# Altium schematic sheet LPCB235 - RM48 - N2HET.SchDoc
size A3; Address1: Unit 4; DocumentNumber: 29; Revision: 2; SheetNumber: 29; SheetTotal: 37; Lockie__PCB_SUB_ASSEMBLY: N2HET; Lockie__PCB_ASSEMBLY: FCU PCB; Lockie__LDL: LPCB235; Lockie__PCB_DESCRIPTION: Flight Control Unit
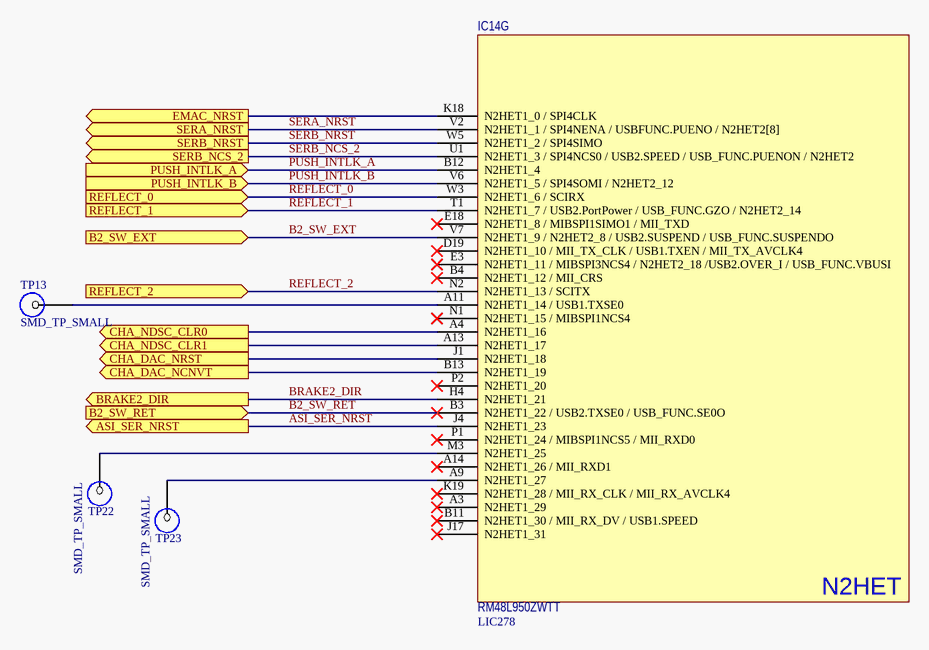
[diagram p0: LPCB235 - RM48 - N2HET.SchDoc]

## Parts
IC14  RM48L950ZWTT  LDL_NUMBER: LIC278  [LFP054__ZWT (S-PBGA-N337)]  (part G of 10)
TP13  SMD_TP_SMALL  [SMD-TP-SMALL]  (no BOM)
TP22  SMD_TP_SMALL  [SMD-TP-SMALL]  (no BOM)
TP23  SMD_TP_SMALL  [SMD-TP-SMALL]  (no BOM)

## Ports
ASI_SER_NRST (out), B2_SW_EXT (in), B2_SW_RET (in), BRAKE2_DIR (out), CHA_DAC_NCNVT (out), CHA_DAC_NRST (out), CHA_NDSC_CLR0 (out), CHA_NDSC_CLR1 (out), EMAC_NRST (out), PUSH_INTLK_A (in), PUSH_INTLK_B (in), REFLECT_0 (in), REFLECT_1 (in), REFLECT_2 (in), SERA_NRST (out), SERB_NCS_2 (out), SERB_NRST (out)

## Nets
ASI_SER_NRST: IC14.J4(N2HET1_23) ; port ASI_SER_NRST
B2_SW_EXT: IC14.V7(N2HET1_9_/_N2HET2_8_/_USB2.SUSPEND_/_USB_FUNC.SUSPENDO) ; port B2_SW_EXT
B2_SW_RET: IC14.B3(N2HET1_22_/_USB2.TXSE0_/_USB_FUNC.SE0O) ; port B2_SW_RET
BRAKE2_DIR: IC14.H4(N2HET1_21) ; port BRAKE2_DIR
CHA_DAC_NCNVT: IC14.B13(N2HET1_19) ; port CHA_DAC_NCNVT
CHA_DAC_NRST: IC14.J1(N2HET1_18) ; port CHA_DAC_NRST
CHA_NDSC_CLR0: IC14.A4(N2HET1_16) ; port CHA_NDSC_CLR0
CHA_NDSC_CLR1: IC14.A13(N2HET1_17) ; port CHA_NDSC_CLR1
EMAC_NRST: IC14.K18(N2HET1_0_/_SPI4CLK) ; port EMAC_NRST
PUSH_INTLK_A: IC14.B12(N2HET1_4) ; port PUSH_INTLK_A
PUSH_INTLK_B: IC14.V6(N2HET1_5_/_SPI4SOMI_/_N2HET2_12) ; port PUSH_INTLK_B
REFLECT_0: IC14.W3(N2HET1_6_/_SCIRX) ; port REFLECT_0
REFLECT_1: IC14.T1(N2HET1_7_/_USB2.PortPower_/_USB_FUNC.GZO_/_N2HET2_14) ; port REFLECT_1
REFLECT_2: IC14.N2(N2HET1_13_/_SCITX) ; port REFLECT_2
SERA_NRST: IC14.V2(N2HET1_1_/_SPI4NENA_/_USBFUNC.PUENO_/_N2HET2[8]) ; port SERA_NRST
SERB_NCS_2: IC14.U1(N2HET1_3_/_SPI4NCS0_/_USB2.SPEED_/_USB_FUNC.PUENON_/_N2HET2) ; port SERB_NCS_2
SERB_NRST: IC14.W5(N2HET1_2_/_SPI4SIMO) ; port SERB_NRST
NetIC14_A9: IC14.A9(N2HET1_27) TP23.1
NetIC14_A11: IC14.A11(N2HET1_14_/_USB1.TXSE0) TP13.1
NetIC14_M3: IC14.M3(N2HET1_25) TP22.1

Not connected (* = marked no-connect by the designer): IC14 A3(N2HET1_29)* A14(N2HET1_26_/_MII_RXD1)* B4(N2HET1_12_/_MII_CRS)* B11(N2HET1_30_/_MII_RX_DV_/_USB1.SPEED)* D19(N2HET1_10_/_MII_TX_CLK_/_USB1.TXEN_/_MII_TX_AVCLK4)* E3(N2HET1_11_/_MIBSPI3NCS4_/_N2HET2_18_/USB2.OVER_I_/_USB_FUNC.VBUSI)* E18(N2HET1_8_/_MIBSPI1SIMO1_/_MII_TXD)* J17(N2HET1_31)* K19(N2HET1_28_/_MII_RX_CLK_/_MII_RX_AVCLK4)* N1(N2HET1_15_/_MIBSPI1NCS4)* P1(N2HET1_24_/_MIBSPI1NCS5_/_MII_RXD0)* P2(N2HET1_20)*

## Notes on the sheet
- PCB COMPONENT DESCRIPTION
- LDL NUMBER
- Assembly Details
- Size
- Drawing File Name
- Revision
- http://rloop.org
- Scale
- A3
- Sheet Details
- N.T.S
- Sheet:
- Of:
- (in symbol RM48L950ZWTT, part G) N2HET

## Library data of the parts
IC14 = RM48L950ZWTT: IC, CPU, RM48 Safety CPU, SMD NFBGA337 [LIC278]; FMEDA__FUNCTION_IN_SYSTEM: SAFETY CPU 1; FMEDA__OPERATING__TEMP_MIN: -20; FMEDA__OPERATING__TEMP_TYP: 27; FMEDA__OPERATING__TEMP_MAX: 50; FMEDA__CHANNEL: COM
TP13 TP22 TP23 = SMD_TP_SMALL: SMD Test Point; FMEDA__CHANNEL: COM; FMEDA__OPERATING__CURRENT_MAX: 0; FMEDA__OPERATING__TEMP_MAX: 50; FMEDA__OPERATING__TEMP_MIN: -20; FMEDA__OPERATING__TEMP_TYP: 27; FMEDA__OPERATING__VOLTAGE_MAX: 16; FMEDA__OPERATING__VOLTAGE_TYP: 12; FMEDA__OPERATING__CURRENT_MIN: 0; FMEDA__OPERATING__CURRENT_TYP: 0; FMEDA__OPERATING__VOLTAGE_MIN: 0